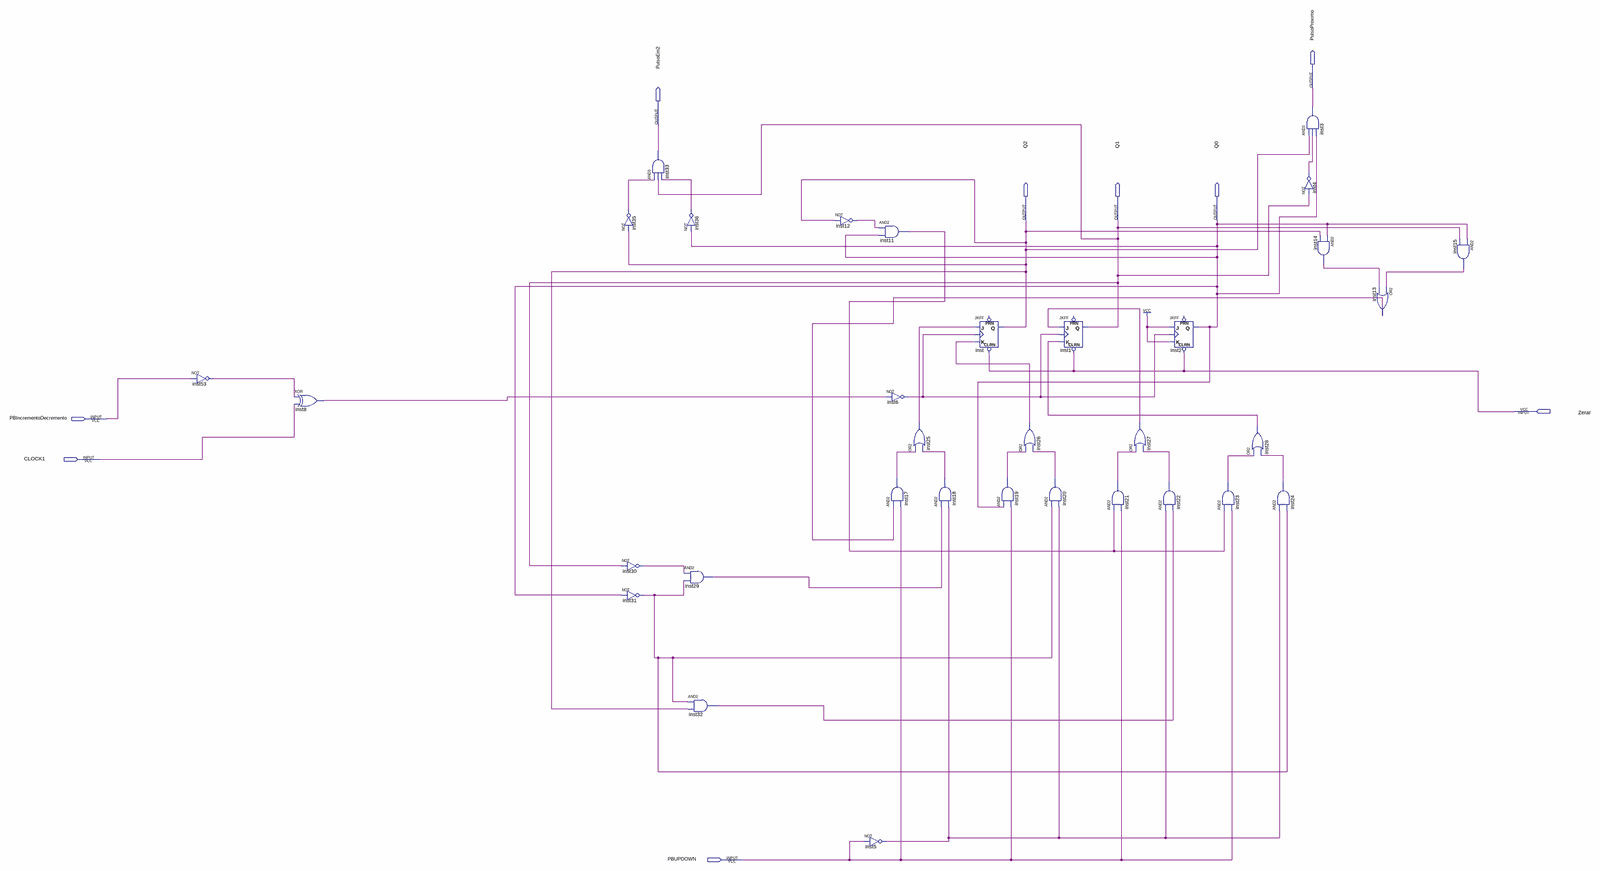
[diagram p0: schematic sheet, whole]
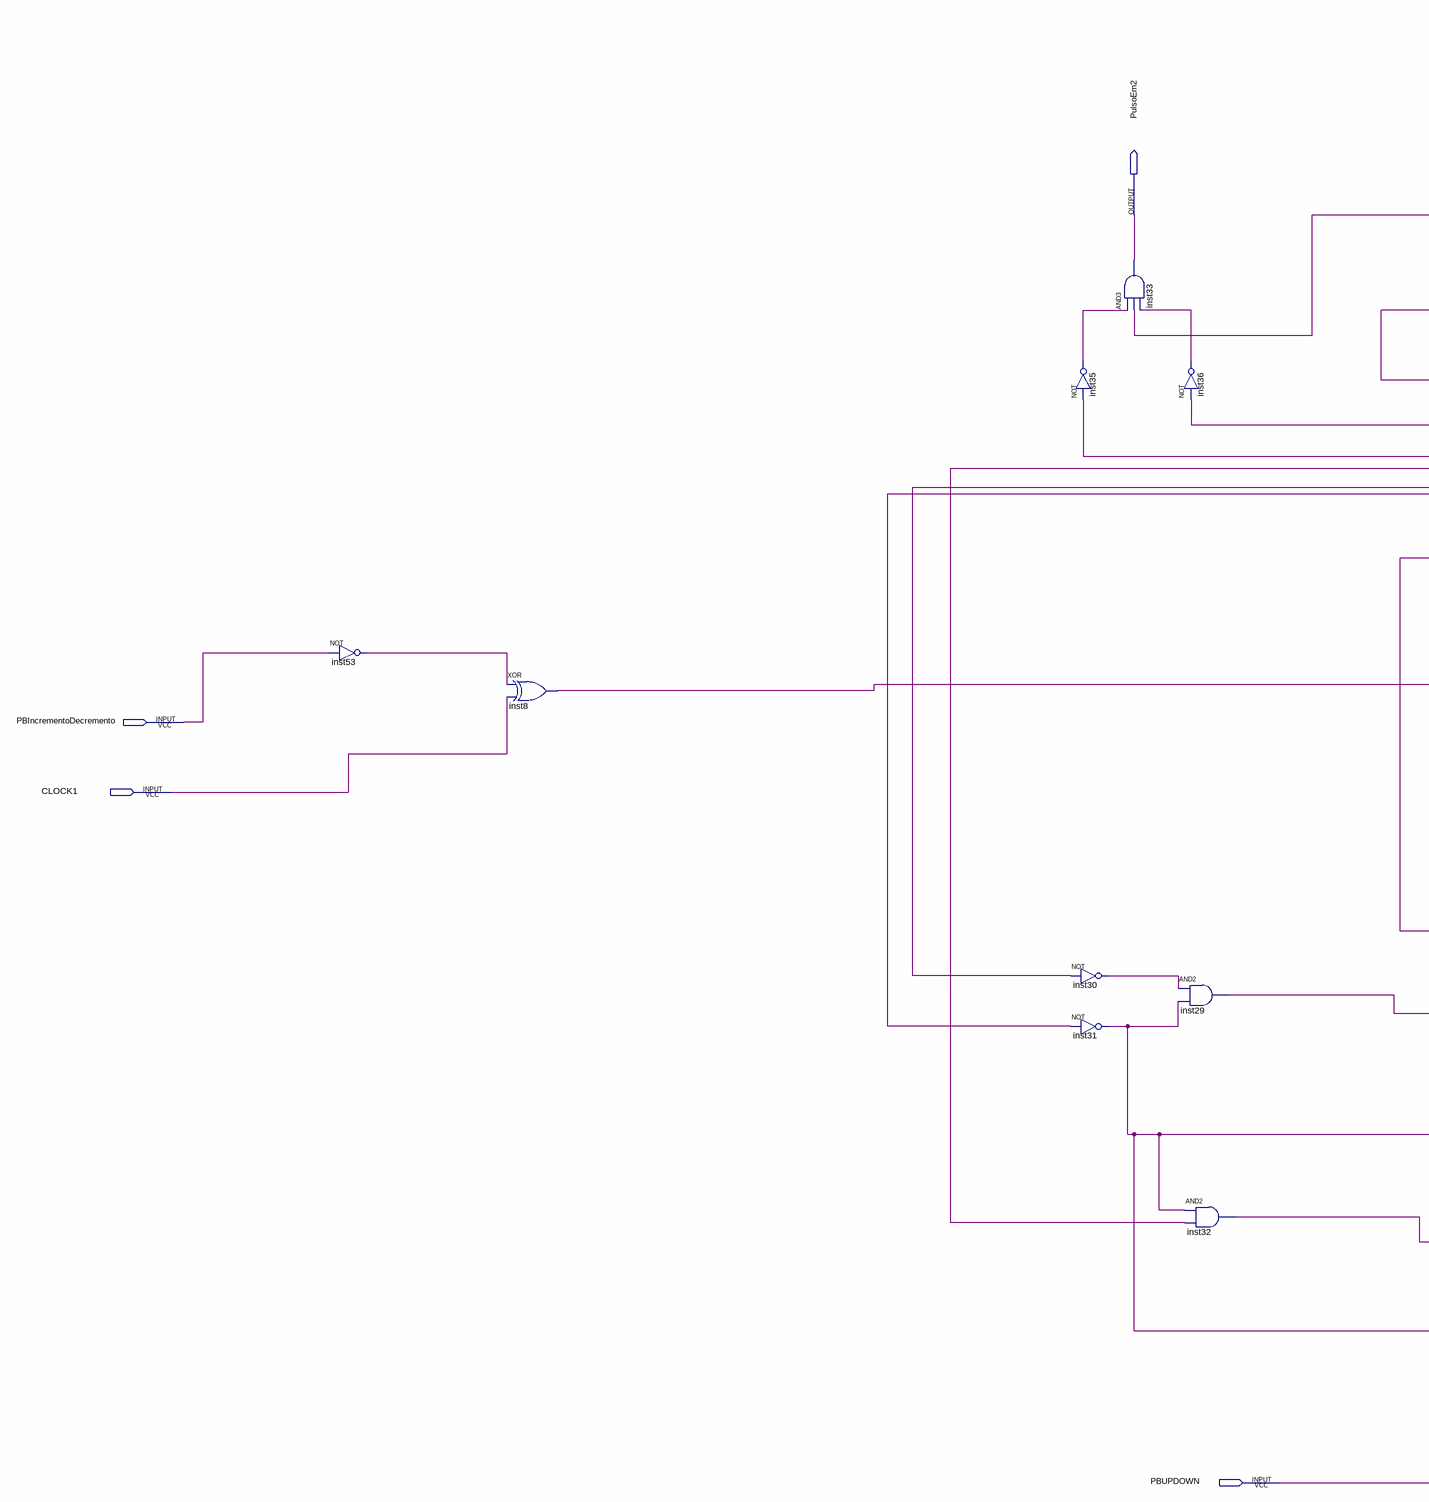
[diagram p1: schematic sheet, left part]
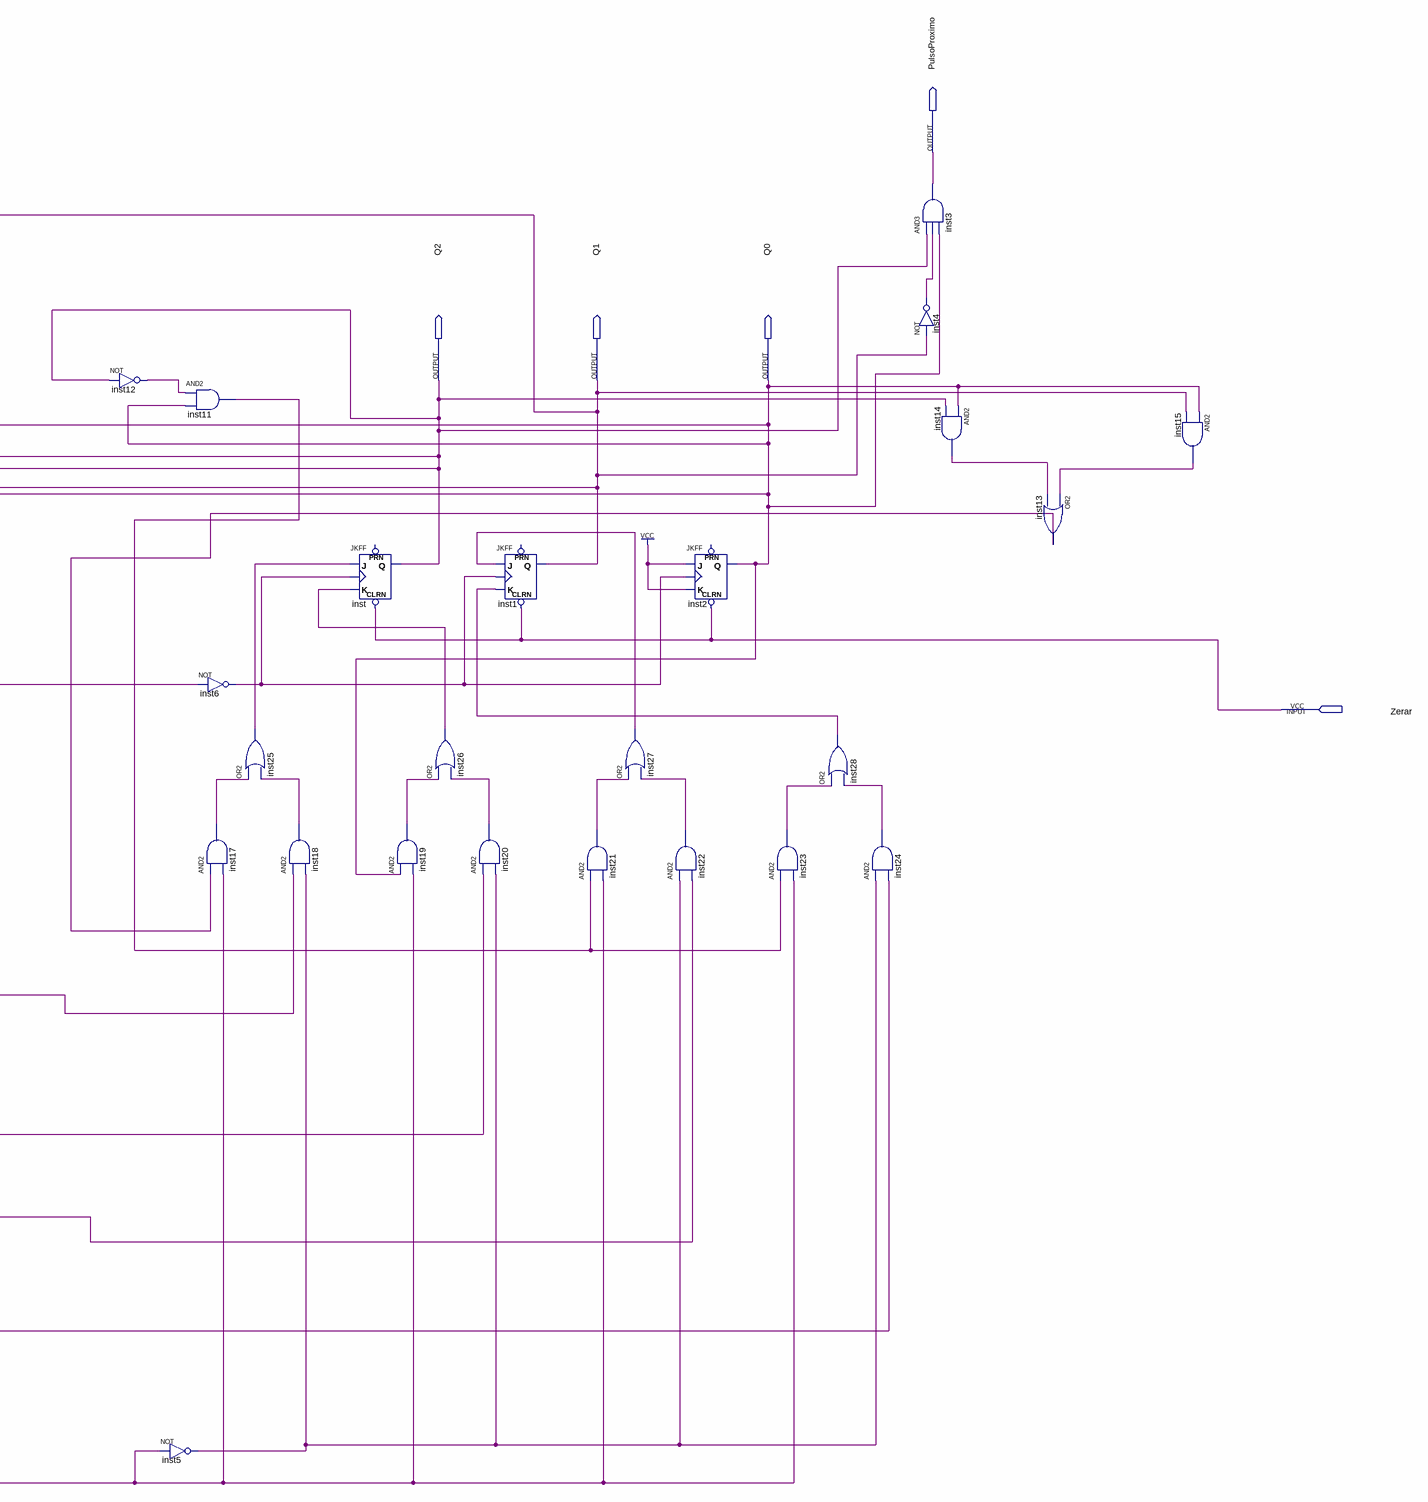
[diagram p2: schematic sheet, right part]
// Quartus schematic Contador0a5Horas.bdf as structural Verilog: 33 symbols, 9 pins
module Contador0a5Horas (
  input  Zerar,
  input  PBIncrementoDecremento,
  input  CLOCK1,
  input  PBUPDOWN,
  output PulsoProximo,
  output PulsoEm2,
  output Q2,
  output Q1,
  output Q0
);

  wire inst4_out, inst5_out, inst6_out, inst8_out, inst11_out, inst12_out, inst13_out, inst14_out,
       inst15_out, inst17_out, inst18_out, inst19_out, inst20_out, inst21_out, inst22_out, inst23_out,
       inst24_out, inst25_out, inst26_out, inst27_out, inst28_out, inst29_out, inst30_out, inst31_out,
       inst32_out, inst35_out, inst36_out, inst53_out;

  not inst53 (inst53_out, PBIncrementoDecremento);
  xor inst8 (inst8_out, inst53_out, CLOCK1);
  not inst35 (inst35_out, Q2);
  not inst30 (inst30_out, Q1);
  not inst31 (inst31_out, Q0);
  and inst33 (PulsoEm2, inst35_out, Q1, inst36_out);
  not inst36 (inst36_out, Q0);
  and inst29 (inst29_out, inst30_out, inst31_out);
  and inst32 (inst32_out, inst31_out, Q2);
  not inst12 (inst12_out, Q2);
  and inst11 (inst11_out, inst12_out, Q0);
  not inst6 (inst6_out, inst8_out);
  and inst17 (inst17_out, inst13_out, PBUPDOWN);
  not inst5 (inst5_out, PBUPDOWN);
  or inst25 (inst25_out, inst17_out, inst18_out);
  and inst18 (inst18_out, inst29_out, inst5_out);
  JKFF inst (.CLRN(Zerar), .K(inst26_out), .J(inst25_out), .CLK(inst6_out), .Q(Q2));  // open: PRN
  and inst19 (inst19_out, Q0, PBUPDOWN);
  or inst26 (inst26_out, inst19_out, inst20_out);
  JKFF inst1 (.CLRN(Zerar), .K(inst28_out), .J(inst27_out), .CLK(inst6_out), .Q(Q1));  // open: PRN
  and inst20 (inst20_out, inst31_out, inst5_out);
  and inst21 (inst21_out, inst11_out, PBUPDOWN);
  or inst27 (inst27_out, inst21_out, inst22_out);
  JKFF inst2 (.CLRN(Zerar), .K(1'b1), .J(1'b1), .CLK(inst6_out), .Q(Q0));  // open: PRN
  and inst22 (inst22_out, inst5_out, inst32_out);
  and inst23 (inst23_out, inst11_out, PBUPDOWN);
  or inst28 (inst28_out, inst23_out, inst24_out);
  and inst24 (inst24_out, inst5_out, inst31_out);
  and inst3 (PulsoProximo, Q2, inst4_out, Q0);
  not inst4 (inst4_out, Q1);
  and inst14 (inst14_out, Q0, Q2);
  or inst13 (inst13_out, inst15_out, inst14_out);
  and inst15 (inst15_out, Q0, Q1);
endmodule
